# EAGLE design amp (EAGLE 9.4.2)
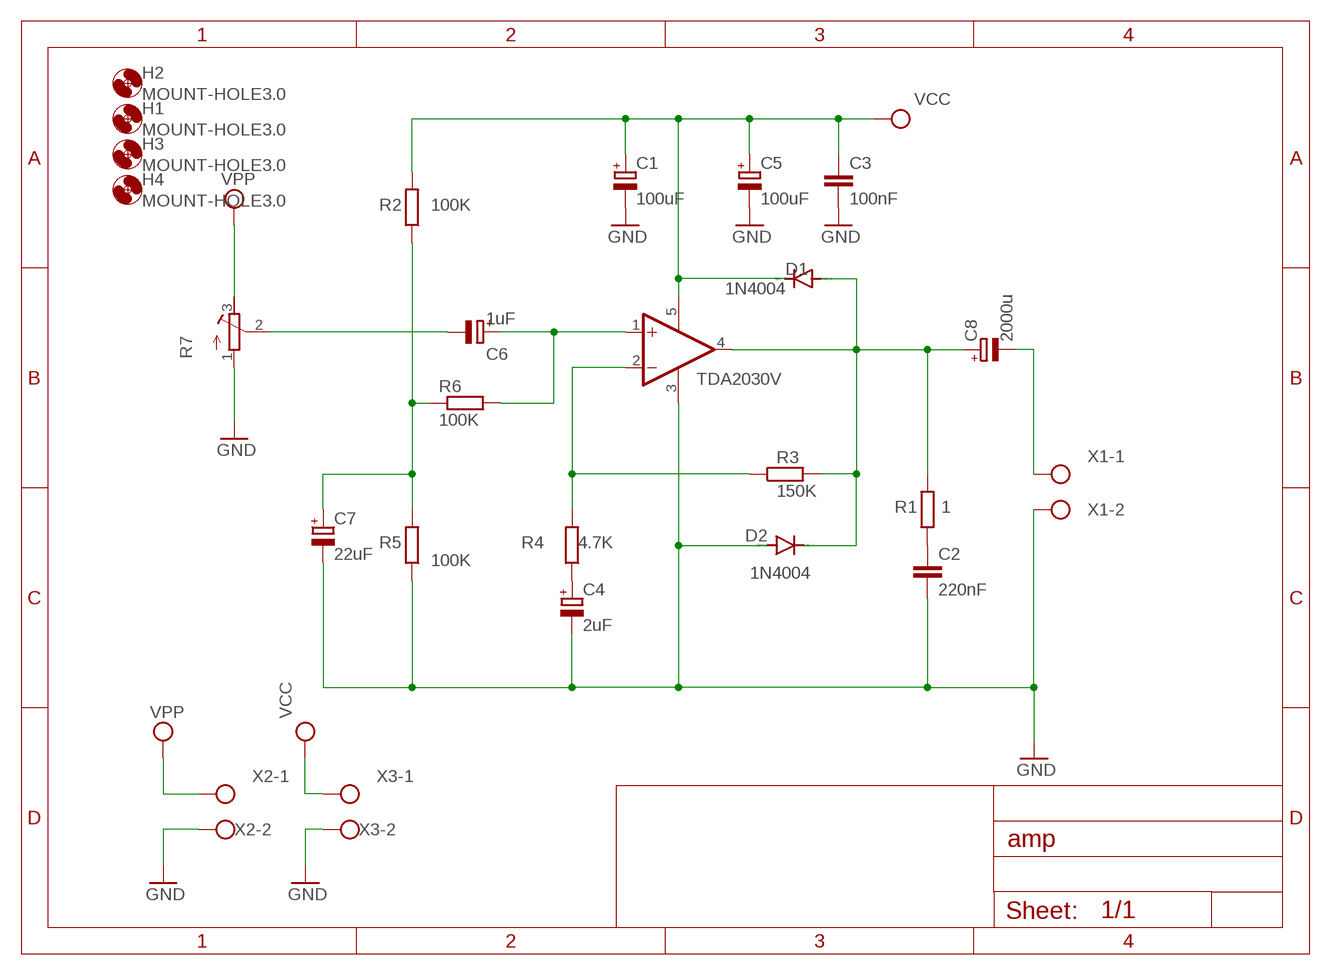
[diagram p0: schematic, sheet 1]

## Parts
C1  100uF  CPOL-EUE10-25  [EB25D]
C2  220nF  C2,5-3  [C2.5-3]
C3  100nF  C2,5-3  [C2.5-3]
C4  2uF  CPOL-EUE2.5-7  [E2,5-7]
C5  100uF  CPOL-EUE10-25  [EB25D]
C6  1uF  CPOL-EUE2.5-7  [E2,5-7]
C7  22uF  CPOL-EUE2.5-7  [E2,5-7]
C8  2000u  CPOL-EUE10-35  [EB35D]
D1  1N4004  [DO41-10]
D2  1N4004  [DO41-10]
H1  MOUNT-HOLE3.0  [3,0]
H2  MOUNT-HOLE3.0  [3,0]
H3  MOUNT-HOLE3.0  [3,0]
H4  MOUNT-HOLE3.0  [3,0]
IC1  TDA2030V  [CB360]
R1  1  R-EU_0207/12  [0207/12]
R2  100K  R-EU_0207/12  [0207/12]
R3  150K  R-EU_0207/12  [0207/12]
R4  4.7K  R-EU_0207/12  [0207/12]
R5  100K  R-EU_0207/12  [0207/12]
R6  100K  R-EU_0207/12  [0207/12]
R7  R-TRIMM3296W  [RTRIM3296W]
X1  W237-113  [W237-113]
X2  W237-113  [W237-113]
X3  W237-113  [W237-113]

## Nets
GND: C1.- C2.2 C3.2 C4.- C5.- C7.- D2.A IC1.3(GND) R5.1 R7.1(A) X1.2 X2.2 X3.2
N$1: C4.+ R4.1
N$2: C8.- X1.1
N$3: C6.+ IC1.1(+IN) R6.2
N$4: C8.+ D1.A D2.C IC1.4(OUT) R1.2 R3.2
N$5: C2.1 R1.1
N$6: C7.+ R2.1 R5.2 R6.1
N$7: IC1.2(-IN) R3.1 R4.2
N$9: C6.- R7.2(S)
VCC: C1.+ C3.1 C5.+ D1.C IC1.5(V+) R2.2 X3.1
VPP: R7.3(E) X2.1

## Library data of the parts
C1 C4-C8 = resistor:CPOL-EU: POLARIZED CAPACITOR, European symbol
C2 C3 = capacitor-wima:C: CAPACITOR naming: grid - package width
D1 D2 = diode:1N4004: DIODE general purpose rectifier, 1 A
H1-H4 = holes:MOUNT-HOLE: MOUNTING HOLE with drill center marker
IC1 = linear:TDA2030: Power OP AMP
R1-R6 = rcl:R-EU_: RESISTOR, European symbol; SPICEPREFIX: R
R7 = resistor:R-TRIMM: Trimm resistor
X1-X3 = con-wago-500:W237-113: WAGO SCREW CLAMP; OC_FARNELL: unknown; OC_NEWARK: unknown

## Board
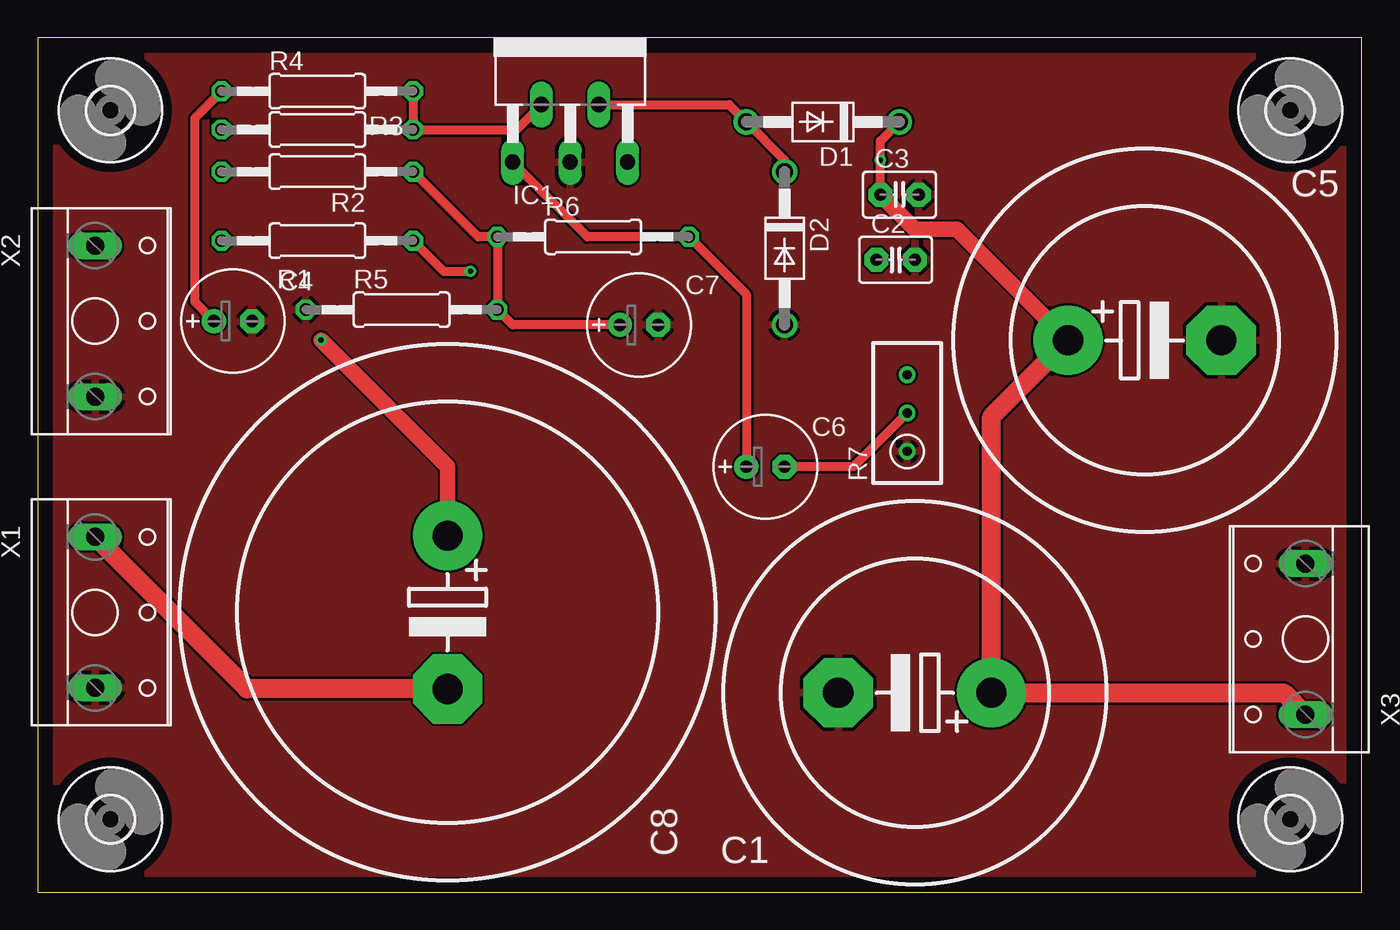
[diagram p1: board, top side]
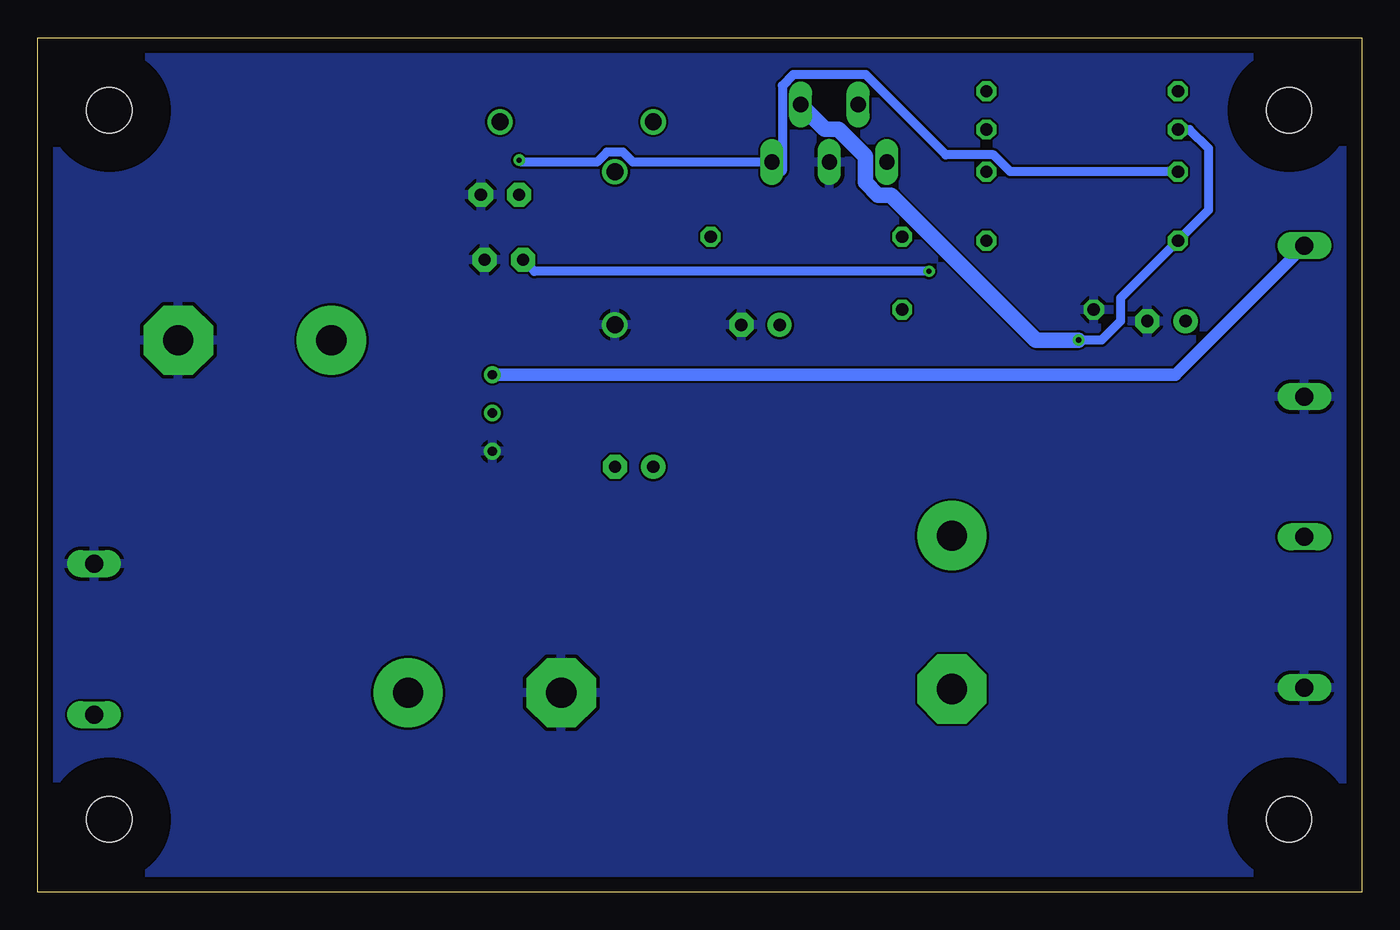
[diagram p2: board, bottom side, seen from below]

Size 87.81 x 56.63 mm. Coordinates in mm from the lower left corner, seen from the top.
Outline: 0,0 87.81,0 87.81,56.63 0,56.63 0,0
Copper layers (1*16): Top 0.035mm / dielectric 1.5mm / Bottom 0.035mm
Design rules "default": minimum track width 6mil, minimum drill 0.35mm, track to track 6mil, track to pad 6mil, pad to pad 6mil, via to via 6mil, smd to smd 6mil, copper to edge 40mil, drill to drill 6mil, minimum pad ring 10mil, minimum via ring 8mil, stop-mask expansion 4mil, vias tented up to drill 0mil, thermal gap 10mil

### Footprints (pad centres in the part's own frame; a part is rotated, then mirrored left to right if it is on the bottom)
EB25D = drill 2.007 pad 4.597: + -5.08,0 | drill 2.007 pad 4.597 octagon: - 5.08,0
C2.5-3 = drill 0.813 pad 1.6 octagon: 1 -1.27,0; 2 1.27,0
E2,5-7 = drill 0.813 pad 1.6: + -1.27,0 | drill 0.813 pad 1.6 octagon: - 1.27,0
EB35D = drill 2.007 pad 4.597: + -5.08,0 | drill 2.007 pad 4.597 octagon: - 5.08,0
DO41-10 = drill 1.118: A 5.08,0; C -5.08,0
3,0 = hole 3: 0,0
CB360 = drill 1.016 long: 1 -3.81,-8.255; 2 -1.905,-4.445; 3 0,-8.255; 4 1.905,-4.445; 5 3.81,-8.255
0207/12 = drill 0.813 octagon: 1 -6.35,0; 2 6.35,0
RTRIM3296W = drill 0.61: 1 0,-2.54; 2 0,0; 3 0,2.54
W237-113 = drill 1.194 long: 1 -5,-1.27; 2 5,-1.27

### Placement (x,y rotation side)
C1  58.17,13.21 180 top
C2  56.9,41.91 0 top
C3  57.15,46.23 0 top
C4  12.95,37.85 0 top
C5  73.41,36.58 0 top
C6  48.26,28.19 0 top
C7  39.88,37.59 0 top
C8  27.18,18.54 270 top
D1  52.07,51.05 180 top
D2  49.53,42.67 270 top
H1  4.83,4.83 0 top
H2  4.83,51.82 0 top
H3  83.06,4.83 0 top
H4  83.06,51.82 0 top
IC1  35.31,56.64 0 top
R1  18.54,43.18 180 top
R2  18.54,47.75 180 top
R3  18.54,50.55 180 top
R4  18.54,53.09 0 top
R5  24.13,38.61 0 top
R6  36.83,43.43 0 top
R7  57.66,31.75 0 top
X1  5.08,18.54 270 top
X2  5.08,37.85 270 top
X3  82.8,16.76 90 top

### Tracks (layer width: path | path; a pad name or v marks a point on that pad's centre or on a via)
GND
  pour Bottom: -3.81,59.94 -3.81,-4.83 -3.56,-5.08 92.96,-5.08 93.47,-4.57 93.47,59.69 -3.56,59.69
  pour Top: -3.81,60.71 -3.81,-5.08 93.22,-5.08 93.73,-4.57 93.73,60.2 93.47,60.45 -3.56,60.45
N$1
  Top 0.61: R4.1 10.41,51.31 10.41,39.12 C4.+
N$2
  Top 1.27: C8.- 13.89,13.46 X1.1
N$3
  Top 0.61: C6.+ 46.99,39.62 R6.2 36.45,43.43 IC1.1
N$4  (via drill 0.35)
  Top 0.61: D2.C 49.53,48.51 D1.A 45.85,52.2 IC1.4
  Top 1.016: v18.78,36.59 27.18,28.19 C8.+
  Bottom 0.61: R3.2 11.43,50.55 10.16,49.28 10.16,45.21 R1.2 16,39.37 16,37.85 17.26,36.59 v18.78,36.59
  Bottom 1.016: v18.78,36.59 21.6,36.59 31.22,46.2 32.08,46.2 32.92,47.04 32.92,48.77 34.72,50.57 35.58,50.57 IC1.4
N$5  (via drill 0.35)
  Top 0.61: R1.1 26.92,41.15 v28.7,41.15
  Bottom 0.61: v28.7,41.15 54.86,41.15 C2.1
N$6
  Top 0.61: R2.1 29.21,43.43 R6.1 R5.2 31.5,37.59 C7.+
N$7
  Top 0.61: IC1.2 31.75,50.55 R3.1 R4.2
N$9
  Top 0.61: R7.2 54.1,28.19 C6.-
VCC  (via drill 0.35)
  Top 0.61: C3.1 v55.88,48.51 55.88,49.78 D1.C
  Top 1.016: C3.1 58.17,43.94 60.96,43.94 C5.+
  Top 1.27: X3.1 82.63,13.21 C1.+ 63.25,31.5 C5.+
  Bottom 0.61: v55.88,48.51 55.75,48.39 50.73,48.39 50.07,49.05 48.99,49.05 48.33,48.39 IC1.5 38.48,47.75 38.43,47.8 38.43,53.46 37.72,54.18 32.9,54.18 27.59,48.87 24.43,48.87 23.31,47.75 R2.2
VPP
  Bottom 0.813: X2.1 12.37,34.29 R7.3